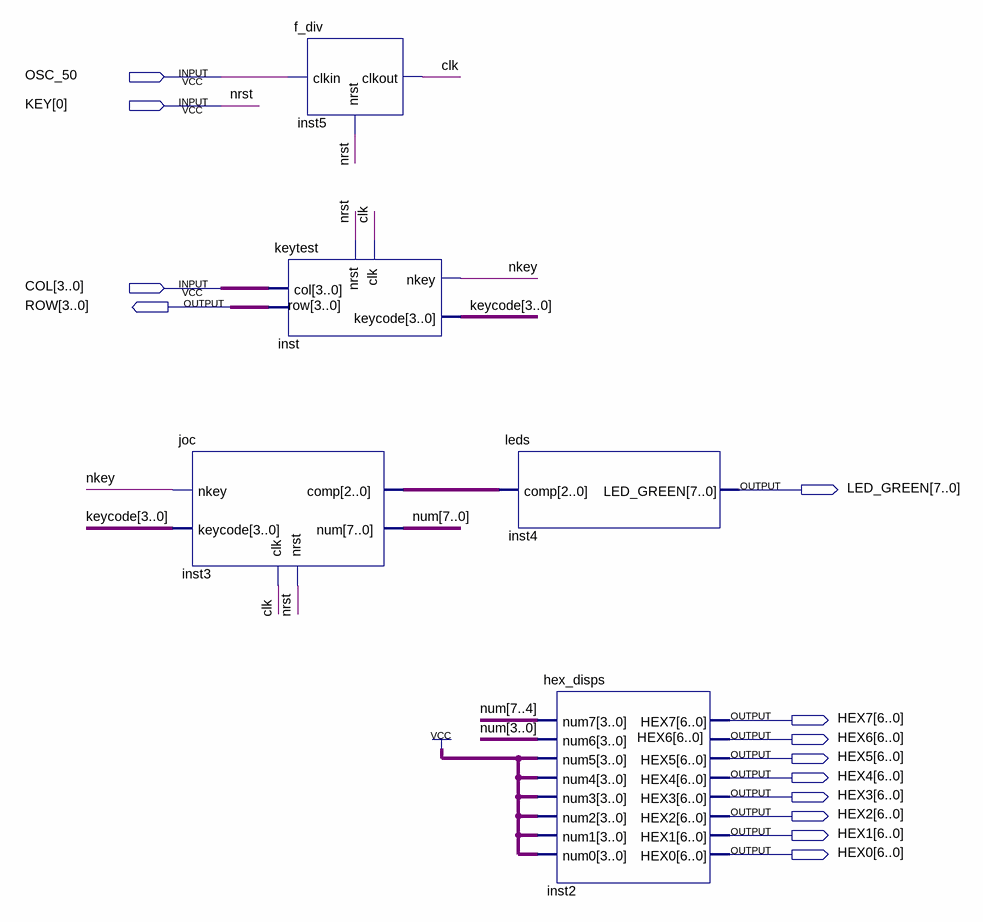
[diagram p0: schematic sheet]
// Quartus schematic jocDE2.bdf as structural Verilog: 5 symbols, 13 pins
module jocDE2 (
  input  OSC_50,
  input  [0:0] KEY,
  input  [3:0] COL,
  output [3:0] ROW,
  output [7:0] LED_GREEN,
  output [6:0] HEX7,
  output [6:0] HEX6,
  output [6:0] HEX5,
  output [6:0] HEX4,
  output [6:0] HEX3,
  output [6:0] HEX2,
  output [6:0] HEX1,
  output [6:0] HEX0
);

  wire clk, nkey;
  wire [2:0] inst3_comp;
  wire [3:0] keycode;
  wire [7:0] num;

  joc inst3 (.nkey(nkey), .keycode(keycode), .clk(clk), .nrst(KEY[0]), .comp(inst3_comp), .num(num));
  keytest inst (.clk(clk), .nrst(KEY[0]), .col(COL), .nkey(nkey), .keycode(keycode), .row(ROW));
  f_div inst5 (.nrst(KEY[0]), .clkin(OSC_50), .clkout(clk));
  leds inst4 (.comp(inst3_comp), .LED_GREEN(LED_GREEN));
  hex_disps inst2 (
    .num0(4'b1111), .num1(4'b1111), .num2(4'b1111), .num3(4'b1111), .num4(4'b1111), .num5(4'b1111),
    .num6(num[3:0]), .num7(num[7:4]), .HEX0(HEX0), .HEX1(HEX1), .HEX2(HEX2), .HEX3(HEX3), .HEX4(HEX4),
    .HEX5(HEX5), .HEX6(HEX6), .HEX7(HEX7));

  // Other names for the same wires on the sheet: nrst = KEY[0]
endmodule
